# EAGLE design Genesis (EAGLE 9.6.2)
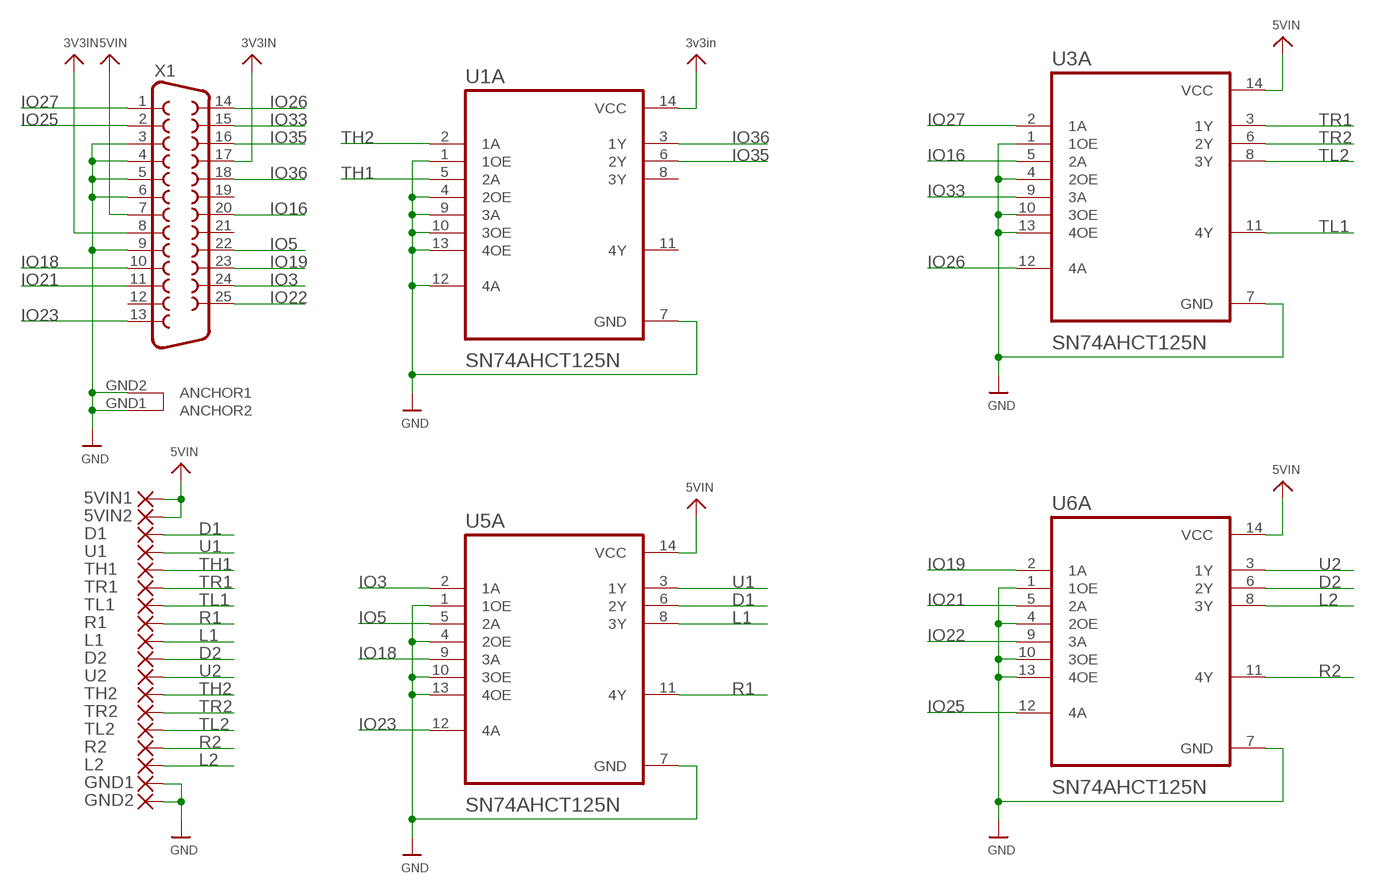
[diagram p0: schematic, sheet 1]

## Parts
5VIN1  SMD5  [SMD2,54-5,08]
5VIN2  SMD5  [SMD2,54-5,08]
D1  SMD5  [SMD2,54-5,08]
D2  SMD5  [SMD2,54-5,08]
GND1  SMD5  [SMD2,54-5,08]
GND2  SMD5  [SMD2,54-5,08]
L1  SMD5  [SMD2,54-5,08]
L2  SMD5  [SMD2,54-5,08]
R1  SMD5  [SMD2,54-5,08]
R2  SMD5  [SMD2,54-5,08]
TH1  SMD5  [SMD2,54-5,08]
TH2  SMD5  [SMD2,54-5,08]
TL1  SMD5  [SMD2,54-5,08]
TL2  SMD5  [SMD2,54-5,08]
TR1  SMD5  [SMD2,54-5,08]
TR2  SMD5  [SMD2,54-5,08]
U1  SMD5  [SMD2,54-5,08]
U1A  SN74AHCT125N  [DIP794W45P254L1969H508Q14]
U2  SMD5  [SMD2,54-5,08]
U3A  SN74AHCT125N  [DIP794W45P254L1969H508Q14]
U5A  SN74AHCT125N  [DIP794W45P254L1969H508Q14]
U6A  SN74AHCT125N  [DIP794W45P254L1969H508Q14]
X1  DB25_FEMALEHP  [F25HP]

## Nets
3V3IN: U1A.14(VCC) X1.8 X1.17 ; supply symbol labelled 3v3in
5VIN: 5VIN1.1(P) 5VIN2.1(P) U3A.14(VCC) U5A.14(VCC) U6A.14(VCC) X1.7
D1: D1.1(P) U5A.6(2Y)
D2: D2.1(P) U6A.6(2Y)
GND: GND1.1(P) GND2.1(P) U1A.1(1OE) U1A.4(2OE) U1A.7(GND) U1A.9(3A) U1A.10(3OE) U1A.12(4A) U1A.13(4OE) U3A.1(1OE) U3A.4(2OE) U3A.7(GND) U3A.10(3OE) U3A.13(4OE) U5A.1(1OE) U5A.4(2OE) U5A.7(GND) U5A.10(3OE) U5A.13(4OE) U6A.1(1OE) U6A.4(2OE) U6A.7(GND) U6A.10(3OE) U6A.13(4OE) X1.3 X1.4 X1.5 X1.6 X1.9 X1.GND1(ANCHOR2) X1.GND2(ANCHOR1)
IO3: U5A.2(1A) X1.24
IO5: U5A.5(2A) X1.22
IO16: U3A.5(2A) X1.20
IO18: U5A.9(3A) X1.10
IO19: U6A.2(1A) X1.23
IO21: U6A.5(2A) X1.11
IO22: U6A.9(3A) X1.25
IO23: U5A.12(4A) X1.13
IO25: U6A.12(4A) X1.2
IO26: U3A.12(4A) X1.14
IO27: U3A.2(1A) X1.1
IO33: U3A.9(3A) X1.15
IO35: U1A.6(2Y) X1.16
IO36: U1A.3(1Y) X1.18
L1: L1.1(P) U5A.8(3Y)
L2: L2.1(P) U6A.8(3Y)
R1: R1.1(P) U5A.11(4Y)
R2: R2.1(P) U6A.11(4Y)
TH1: TH1.1(P) U1A.5(2A)
TH2: TH2.1(P) U1A.2(1A)
TL1: TL1.1(P) U3A.11(4Y)
TL2: TL2.1(P) U3A.8(3Y)
TR1: TR1.1(P) U3A.3(1Y)
TR2: TR2.1(P) U3A.6(2Y)
U1: U1.1(P) U5A.3(1Y)
U2: U2.1(P) U6A.3(1Y)
Unconnected: U1A.8(3Y) U1A.11(4Y) X1.12 X1.19 X1.21

## Library data of the parts
5VIN1 5VIN2 D1 D2 GND1 GND2 L1 L2 R1 R2 TH1 TH2 TL1 TL2 TR1 TR2 U1 U2 = wirepad:SMD5: SMD PAD
U1A U3A U5A U6A = SN74AHCT125N:SN74AHCT125N: None Check prices <https://pricing.snapeda.com/parts/SN74AHCT125N/Texas%20Instruments/view-part?ref=eda>; AVAILABILITY: In Stock; DESCRIPTION: Quadruple Bus Buffer Gates With 3-State Outputs 14-PDIP -40 to 125; MF: Texas Instruments; MP: SN74AHCT125N; PACKAGE: PDIP-14 Texas Instruments; PRICE: None; PURCHASE-URL: https://pricing.snapeda.com/search/part/SN74AHCT125N/?ref=eda
X1 = SparkFun-Retired:DB25_FEMALE: 25 Pin male connector. PCB edge mount for regular PCB thicknesses. This connector will connect directly to the back of a PC parallel port or through a normal DB25 extension cable (M/F). SKU: PRT-08287

## Board
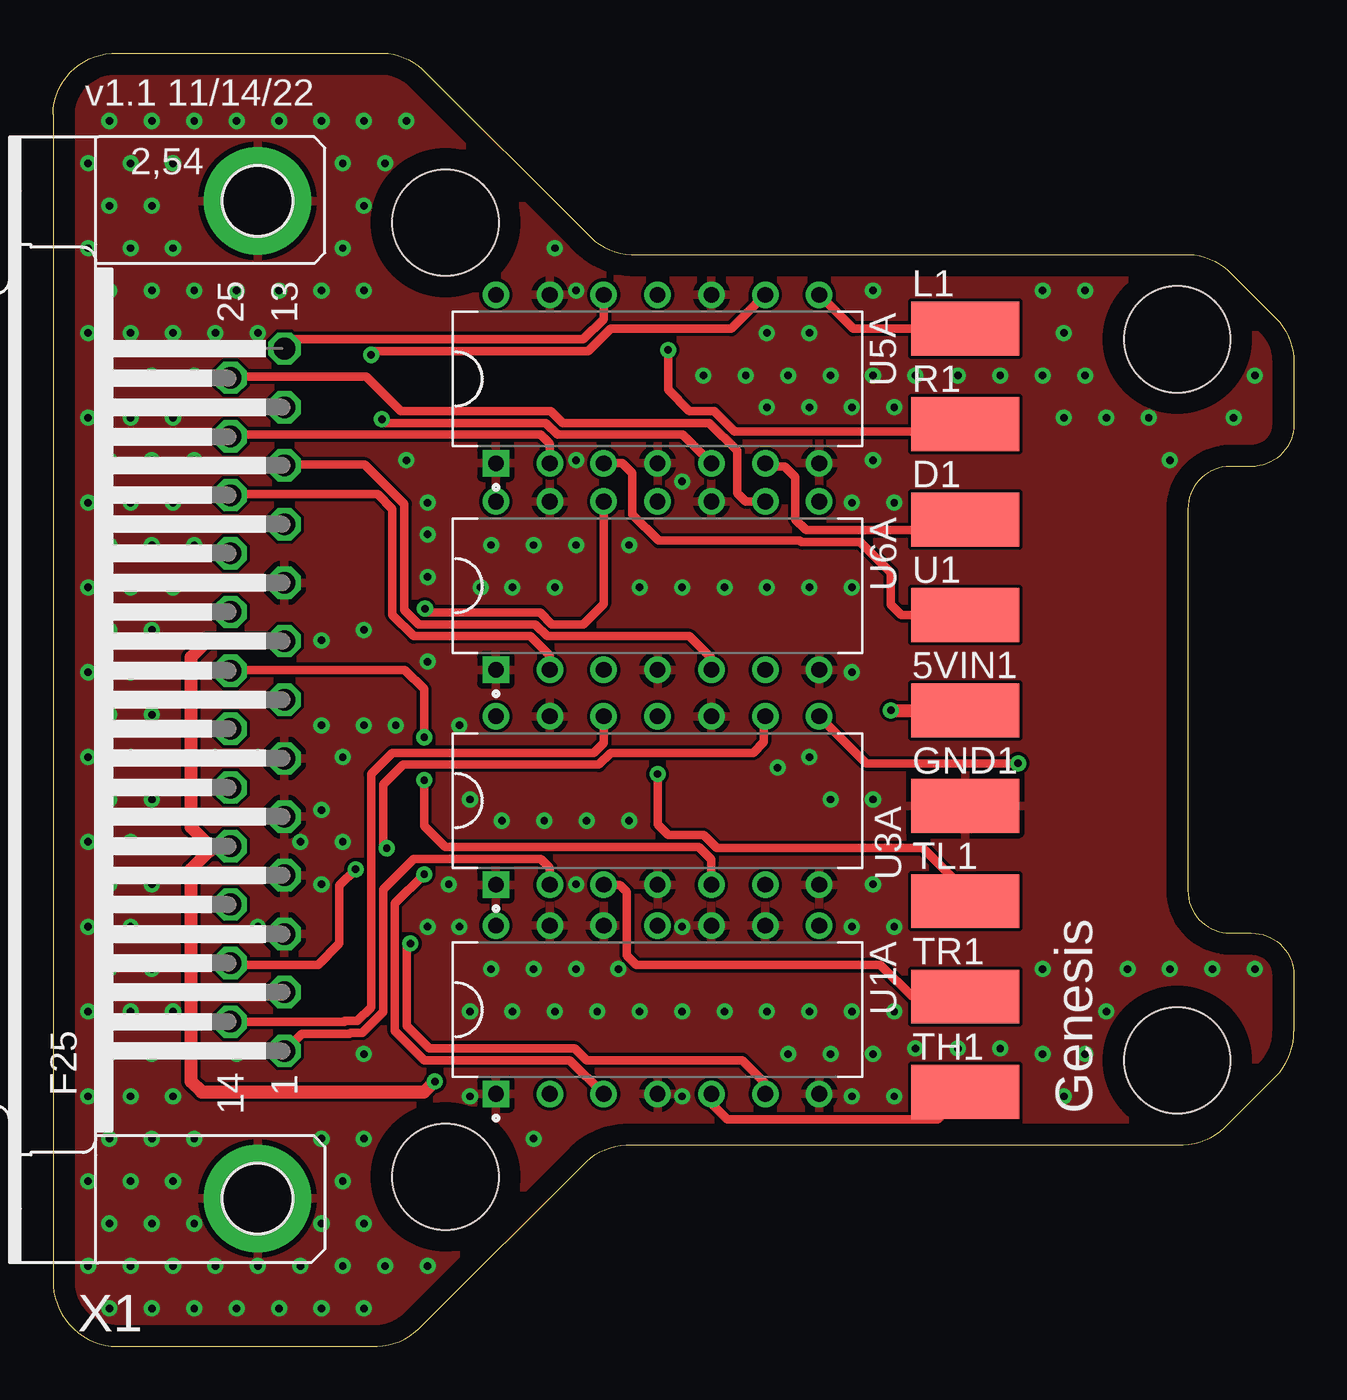
[diagram p1: board, top side]
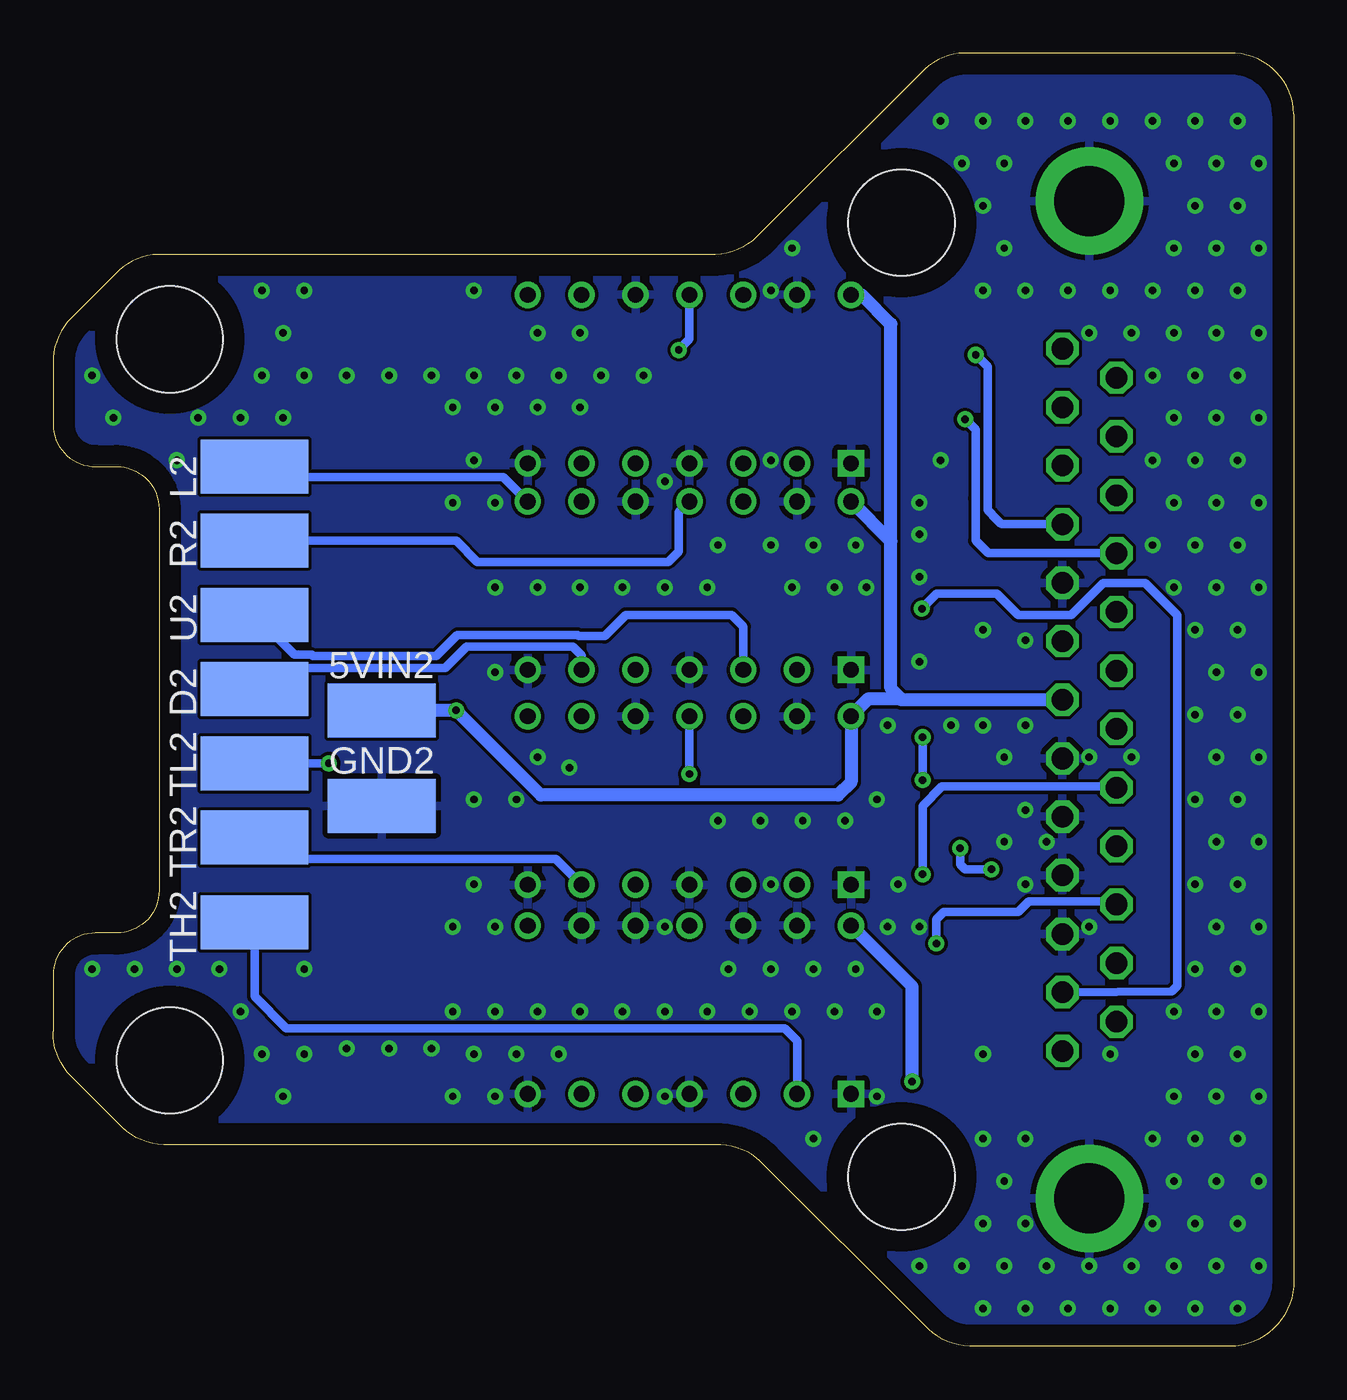
[diagram p2: board, bottom side, seen from below]

Size 58.5 x 61 mm. Coordinates in mm from the lower left corner, seen from the top.
Outline: 0,58.12 0,3.12 arc90 3.03,0 15.29,0 arc45 17.41,1 25.15,8.74 arc-45 27.27,9.5 53.29,9.5 arc45 55.41,10.5 57.65,12.74 arc45 58.5,14.86 58.5,17.5 arc90 56.5,19.5 55.5,19.5 arc-90 53.5,21.5 53.5,39.5 arc-90 55.5,41.5 56.5,41.5 arc90 58.5,43.5 58.5,46.38 arc45 57.65,48.5 55.41,50.74 arc45 53.29,51.5 27.27,51.5 arc-45 25.15,52.5 17.41,60.24 arc45 15.29,61 3.03,61 arc90 0,58.12
Copper layers (1*16): Top 0.035mm / dielectric 1.5mm / Bottom 0.035mm
Design rules "default": minimum track width 6mil, minimum drill 0.35mm, track to track 6mil, track to pad 6mil, pad to pad 6mil, via to via 6mil, smd to smd 6mil, copper to edge 40mil, drill to drill 6mil, minimum pad ring 10mil, minimum via ring 8mil, stop-mask expansion 4mil, vias tented up to drill 0.5mm, thermal gap 10mil
Holes 5 mm at 53,13.5 53,47.5 18.5,53 18.5,8

### Footprints (pad centres in the part's own frame; a part is rotated, then mirrored left to right if it is on the bottom)
SMD2,54-5,08 = smd 2.54 x 5.08: 1 0,0
DIP794W45P254L1969H508Q14 = drill 0.74 pad 1.14 square: 1 -3.97,7.62 | drill 0.74 pad 1.14: 2 -3.97,5.08; 3 -3.97,2.54; 4 -3.97,0; 5 -3.97,-2.54; 6 -3.97,-5.08; 7 -3.97,-7.62; 8 3.97,-7.62; 9 3.97,-5.08; 10 3.97,-2.54; 11 3.97,0; 12 3.97,2.54; 13 3.97,5.08; 14 3.97,7.62
F25HP = drill 1.016 octagon: 1 -16.561,-1.27; 2 -13.792,-1.27; 3 -11.049,-1.27; 4 -8.28,-1.27; 5 -5.512,-1.27; 6 -2.769,-1.27; 7 0,-1.27; 8 2.769,-1.27; 9 5.512,-1.27; 10 8.28,-1.27; 11 11.049,-1.27; 12 13.792,-1.27; 13 16.561,-1.27; 14 -15.189,1.27; 15 -12.421,1.27; 16 -9.652,1.27; 17 -6.909,1.27; 18 -4.14,1.27; 19 -1.372,1.27; 20 1.372,1.27; 21 4.14,1.27; 22 6.909,1.27; 23 9.652,1.27; 24 12.421,1.27; 25 15.189,1.27 | drill 3.302 pad 5.08: GND1 -23.52,0; GND2 23.52,0

### Placement (x,y rotation side)
5VIN1  43,30 270 top
5VIN2  43,30 270 bottom
D1  43,39 270 top
D2  49,31 270 bottom
GND1  43,25.5 270 top
GND2  43,25.5 270 bottom
L1  43,48 270 top
L2  49,41.5 270 bottom
R1  43,43.5 270 top
R2  49,38 270 bottom
TH1  43,12 270 top
TH2  49,20 270 bottom
TL1  43,21 270 top
TL2  49,27.5 270 bottom
TR1  43,16.5 270 top
TR2  49,24 270 bottom
U1  43,34.5 270 top
U1A  28.5,15.88 90 top
U2  49,34.5 270 bottom
U3A  28.5,25.75 90 top
U5A  28.5,45.63 90 top
U6A  28.5,35.88 90 top
X1  9.64,30.5 90 top

### Tracks (layer width: path | path; a pad name or v marks a point on that pad's centre or on a via)
3V3IN  (via drill 0.35)
  Top 0.61: 7.37,23.63 6.5,24.5 6.5,32.5 7.27,33.27 X1.8 | 7.37,23.63 7.37,23.37 6.5,22.5 6.5,12.5 7,12 17.5,12 v18,12.5 | X1.17 7.41,23.59 7.37,23.63
  Bottom 0.61: v18,12.5 18,16.97 U1A.14
5VIN  (via drill 0.35)
  Top 0.61: v39.5,30 5VIN2.1
  Bottom 0.61: 18.5,30.54 20.06,30.54 U3A.14 20.88,26.62 21.5,26 35.5,26 v39.5,30 5VIN2.1 | 18.5,30.54 19,31.04 19,37.97 | 19,37.97 U6A.14 | 19,37.97 19,48.22 20.38,49.6 U5A.14 | X1.7 18.5,30.5 18.5,30.54
D1
  Top 0.406: U5A.6 33.74,41.5 34.5,41.5 35,41 35,39 35.5,38.5 42.5,38.5 D1.1
D2
  Bottom 0.406: U6A.6 33.58,32.58 34,33 39,33 40,32 48,32 D2.1
GND  (via drill 0.35)
  other vias: 2.66,1.8 1.66,3.8 2.66,5.8 1.66,7.8 2.66,9.8 1.66,11.8 2.66,13.8 1.66,15.8 2.66,17.8 1.66,19.8 2.66,21.8 1.66,23.8 2.66,25.8 1.66,27.8 2.66,29.8 1.66,31.8 2.66,33.8 1.66,35.8 2.66,37.8 1.66,39.8 2.66,41.8 1.66,43.8 2.66,45.8 1.66,47.8 2.66,49.8 1.66,51.8 2.66,53.8 1.66,55.8 2.66,57.8 4.66,1.8 3.66,3.8 4.66,5.8 3.66,7.8 4.66,9.8 3.66,11.8 4.66,13.8 3.66,15.8 4.66,17.8 3.66,19.8 4.66,21.8 3.66,23.8 4.66,25.8 3.66,27.8 4.66,29.8 3.66,31.8 4.66,33.8 3.66,35.8 4.66,37.8 3.66,39.8 4.66,41.8 3.66,43.8 4.66,45.8 3.66,47.8 4.66,49.8 3.66,51.8 4.66,53.8 3.66,55.8 4.66,57.8 6.66,1.8 5.66,3.8 6.66,5.8 5.66,7.8 6.66,9.8 5.66,11.8 5.66,15.8 5.66,35.8 6.66,37.8 5.66,39.8 6.66,41.8 5.66,43.8 6.66,45.8 5.66,47.8 6.66,49.8 5.66,51.8 5.66,55.8 6.66,57.8 8.66,1.8 7.66,3.8 8.66,13.8 7.66,27.8 7.66,47.8 8.66,49.8 8.66,57.8 10.66,1.8 9.66,3.8 9.66,19.8 9.66,27.8 9.66,47.8 10.66,49.8 10.66,57.8 12.66,1.8 11.66,3.8 12.66,5.8 12.66,9.8 12.66,21.8 11.66,23.8 12.66,25.3 12.66,29.3 12.66,33.3 12.66,49.8 12.66,57.8 14.66,1.8 13.66,3.8 14.66,5.8 13.66,7.8 14.66,9.8 14.66,13.8 13.66,23.8 13.66,27.8 14.66,29.3 14.66,33.8 14.66,49.8 13.66,51.8 14.66,53.8 13.66,55.8 14.66,57.8 15.66,3.8 16.16,29.3 16.66,41.8 15.66,55.8 16.66,57.8 17.66,3.8 17.66,19.8 18.66,21.8 19.16,29.3 17.66,32.3 17.66,36.3 17.66,39.8 19.66,11.8 19.66,15.8 20.66,17.8 19.16,19.8 20.16,35.8 20.66,37.8 17.66,38.3 22.66,9.8 21.66,15.8 22.66,17.8 21.66,35.8 22.66,37.8 23.66,15.8 24.66,17.8 24.66,21.8 27.16,24.8 21.16,24.8 23.66,35.8 24.66,37.8 24.66,41.8 24.66,49.8 23.66,51.8 25.66,15.8 26.66,17.8 27.16,37.8 27.66,15.8 25.16,24.8 27.66,35.8 29.66,11.8 29.66,15.8 29.66,19.8 19.66,25.8 29.66,35.8 29.66,40.8 30.66,45.8 31.66,15.8 31.66,35.8 32.66,45.8 34.66,13.8 33.66,15.8 34.16,27.3 23.16,24.8 33.66,35.8 33.66,44.3 34.66,45.8 33.66,47.8 36.66,13.8 35.66,15.8 36.66,25.8 35.66,27.8 35.66,35.8 35.66,44.3 36.66,45.8 35.66,47.8 37.66,11.8 38.66,13.8 37.66,15.8 37.66,19.8 38.66,21.8 38.66,25.8 37.66,31.8 37.66,35.8 37.66,39.8 38.66,41.8 37.66,44.3 38.66,45.8 38.66,49.8 39.66,11.8 40.66,14.05 39.66,15.8 39.66,19.8 39.66,39.8 39.66,44.3 40.66,45.8 42.66,14.05 42.66,45.8 44.66,14.05 44.66,45.8 46.66,13.8 46.66,17.8 46.66,45.8 46.66,49.8 47.66,11.8 48.66,13.8 47.66,43.8 48.66,45.8 47.66,47.8 48.66,49.8 49.66,15.8 50.66,17.8 49.66,43.8 52.66,17.8 52.66,41.8 51.66,43.8 54.66,17.8 56.66,17.8 55.66,43.8 56.66,45.8
  pour Bottom: 0,0 0,61.12 28.53,61.12 28.53,51.62 59.03,51.62 59.03,9.5 28.03,9.5 28.03,0
  pour Top: 0,0 0,61.12 28.53,61.12 28.53,51.62 59.03,51.62 59.03,9.5 28.03,9.5 28.03,0
IO3
  Top 0.406: U5A.2 23.42,42.58 23,43 8.45,43 X1.24
IO5  (via drill 0.35)
  Top 0.406: U5A.5 29.7,43 23.79,43 23.23,43.56 15.68,43.56 v15.5,43.73
  Bottom 0.406: v15.5,43.73 15,43.23 15,40 15,38 14.41,37.41 X1.22
IO16  (via drill 0.35)
  Top 0.406: U3A.5 31.04,22.96 30.44,23.56 18.5,23.56 17.5,24.56 v17.5,26.71 | v17.5,28.73 17.5,31 16.59,31.91 8.37,31.91 X1.20
  Bottom 0.406: v17.5,26.71 v17.5,28.73
IO18  (via drill 0.35)
  Top 0.406: U5A.9 31.98,48 26.29,48 25.23,46.94 15.18,46.94 v15,46.77
  Bottom 0.406: v15,46.77 14.44,46.21 14.44,39.44 14,39 13.82,38.82 13.78,38.78 X1.10
IO19
  Top 0.406: U6A.2 23.42,32.58 22.5,33.5 17,33.5 16,34.5 16,39.5 15.31,40.19 8.41,40.19 X1.23
IO21
  Top 0.406: U6A.5 31.04,32.46 30,33.5 23.29,33.5 22.73,34.06 17.23,34.06 16.56,34.73 16.56,39.73 14.7,41.59 10.95,41.59 X1.11
IO22
  Top 0.406: U6A.9 32.65,39.85 32.26,40.24 32.26,42.24 30.94,43.56 24.02,43.56 23.46,44.12 16.38,44.12 14.77,45.73 8.41,45.73 X1.25
IO23
  Top 0.406: U5A.12 25.96,48.46 25,47.5 11.35,47.5 X1.13
IO25  (via drill 0.35)
  Top 0.406: U6A.12 25.96,35.02 25,34.06 23.52,34.06 22.96,34.62 17.71,34.62 v17.54,34.79
  Bottom 0.406: v17.54,34.79 16.83,35.5 14,35.5 13,34.5 10.5,34.5 9,36 7,36 5.5,34.5 5.5,17 5.75,16.75 X1.2
IO26
  Top 0.406: U3A.12 25.96,28.46 25.5,28 16,28 15,27 15,16 14.35,15.35 13.73,15.35 13.73,15.31 X1.14
IO27
  Top 0.406: U3A.2 23.42,22.58 23,23 17,23 15.56,21.56 15.56,15.77 14.58,14.79 14.01,14.79 13.96,14.75 11.72,14.75 X1.1
IO33  (via drill 0.35)
  Top 0.406: U3A.9 33.5,29.64 33.5,28.5 33,28 26.29,28 25.73,27.44 16.5,27.44 15.56,26.5 15.56,23.68 v15.73,23.5 | v14.27,22.5 13.5,21.73 13.5,19 12.5,18 8.37,18 X1.15
  Bottom 0.406: v15.73,23.5 15.73,22.73 15.5,22.5 v14.27,22.5
IO35  (via drill 0.35)
  Top 0.406: U1A.6 33.58,12.42 32.5,13.5 25.16,13.5 24.6,14.06 17.73,14.06 16.68,15.11 16.68,18.82 v16.85,19
  Bottom 0.406: v16.85,19 16.85,20.15 16.5,20.5 13,20.5 12.5,21 8.37,21 X1.16
IO36  (via drill 0.35)
  Top 0.406: U1A.3 24.37,13.5 17.5,13.5 16.12,14.88 16.12,20.88 v17.5,22.27
  Bottom 0.406: v17.5,22.27 17.5,25.5 16.6,26.4 8.37,26.4 X1.18
L1
  Top 0.406: L1.1 37.72,48 U5A.8
L2
  Bottom 0.406: U6A.8 37.27,41 48.5,41 L2.1
R1  (via drill 0.35)
  Top 0.406: v29,47 29,45.12 30,44.12 31.17,44.12 32.15,43.15 42.65,43.15 R1.1
  Bottom 0.406: U5A.11 28.5,47.5 v29,47
R2
  Bottom 0.406: U6A.11 29,39.35 29,37.5 29.5,37 38.5,37 39.5,38 R2.1
TH1
  Top 0.406: U1A.5 31.04,11.46 31.78,10.72 41.72,10.72 TH1.1
TH2
  Bottom 0.406: U1A.2 23.42,14.42 24,15 47.5,15 49,16.5 TH2.1
TL1  (via drill 0.35)
  Top 0.406: TL1.1 43,21.5 41,23.5 31.29,23.5 30.67,24.12 29,24.12 28.5,24.62 v28.5,27
  Bottom 0.406: U3A.11 v28.5,27
TL2  (via drill 0.35)
  Top 0.406: U3A.8 38.34,27.5 v45.5,27.5
  Bottom 0.406: v45.5,27.5 TL2.1
TR1
  Top 0.406: U3A.3 26.72,21.78 27.05,21.45 27.05,18.45 27.5,18 39,18 40.5,16.5 TR1.1
TR2
  Bottom 0.406: U3A.6 34.8,23 48,23 TR2.1
U1
  Top 0.406: U5A.3 26.84,41.66 27.3,41.2 27.3,39.24 28.55,38 35.21,38 35.27,37.94 38.06,37.94 39.5,36.5 39.5,35 40,34.5 U1.1
U2
  Bottom 0.406: U6A.3 25.96,33.96 26.5,34.5 31.5,34.5 32.5,33.5 33.71,33.5 33.77,33.56 39.44,33.56 40.44,32.56 46.25,32.56 46.31,32.63 47.13,32.63 U2.1

### Text on the board
tPlace: v1.1 11/14/22 | Genesis